# EAGLE design oa_sevenfortyfun (EAGLE 6.5.0)
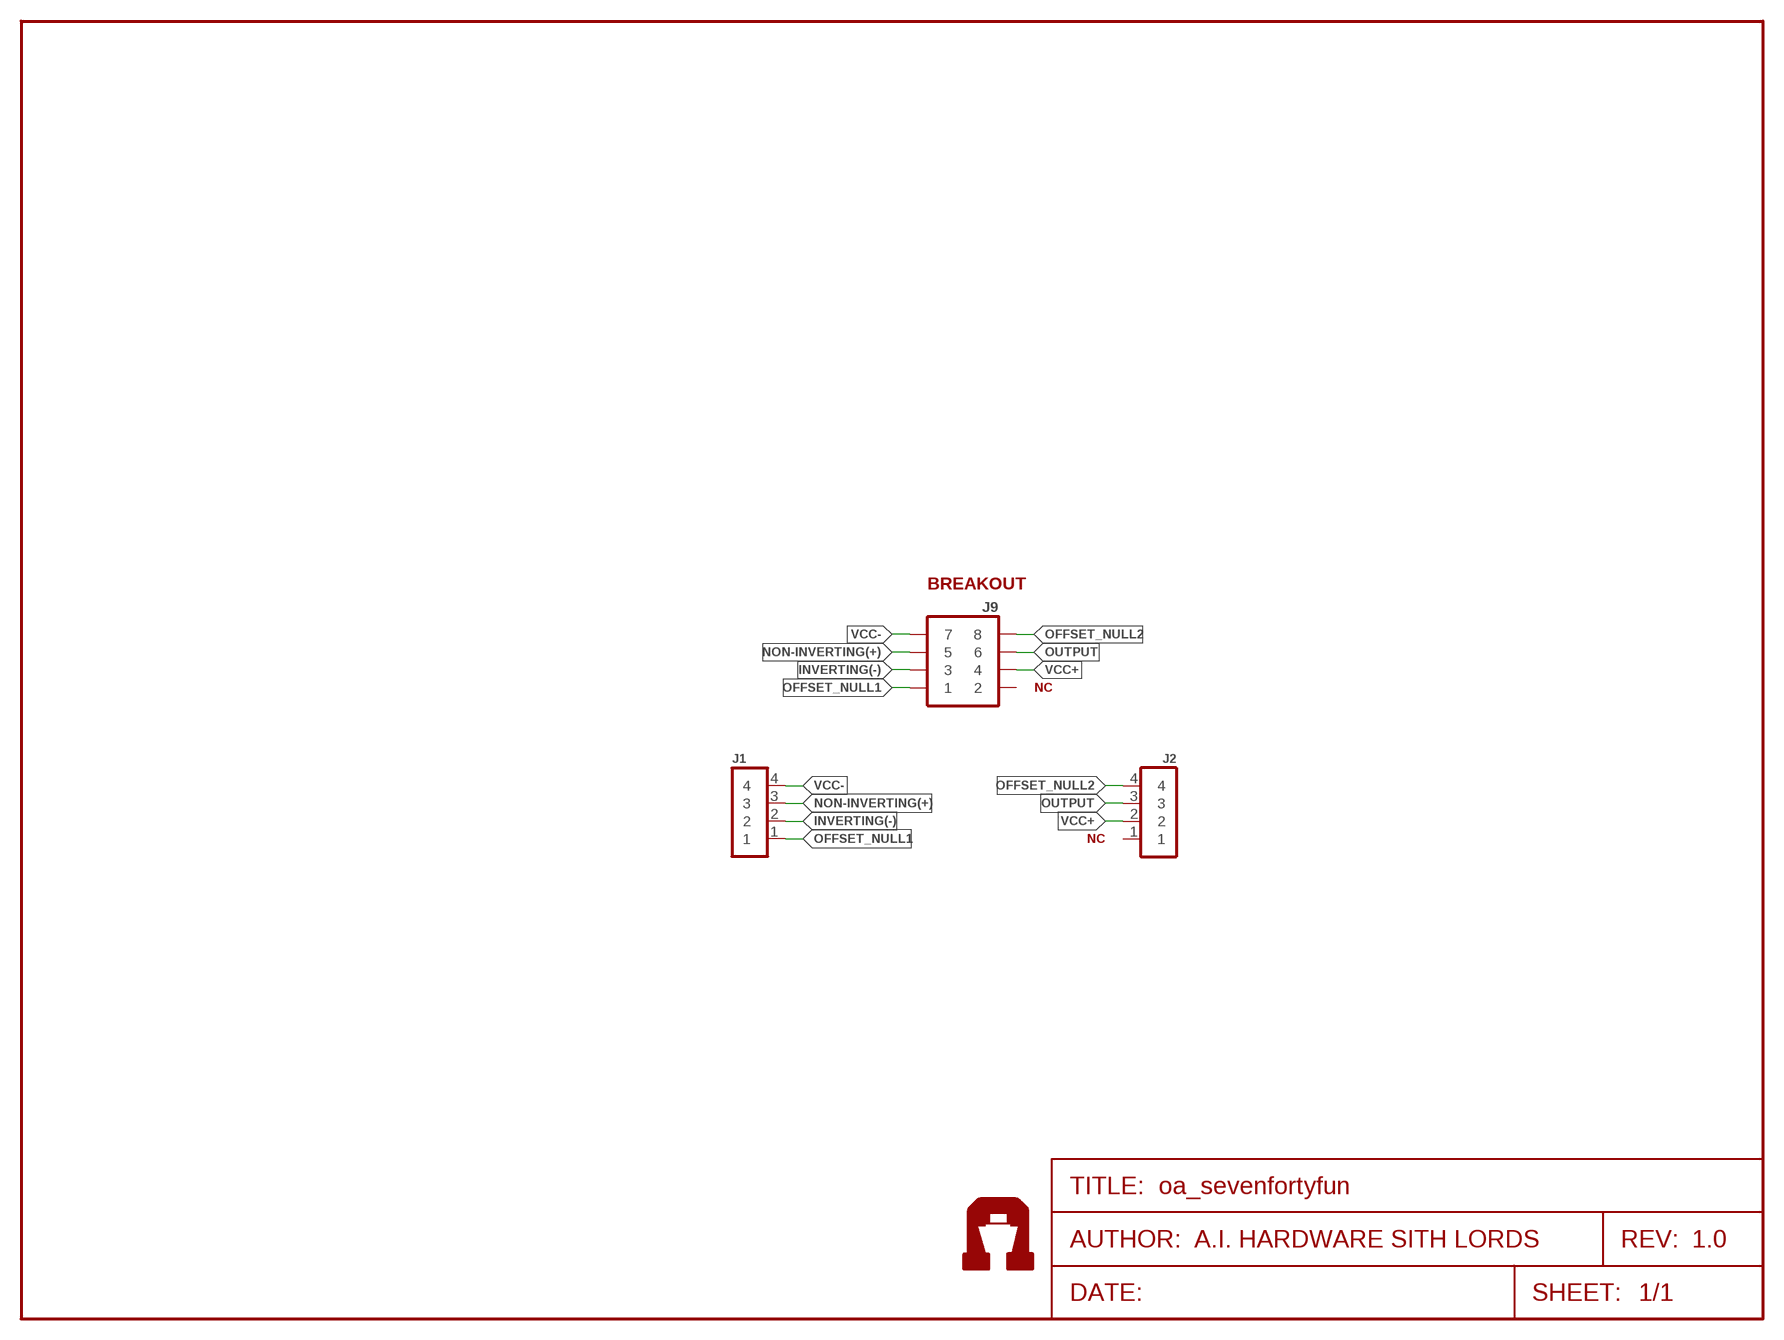
[diagram p0: schematic, sheet 1]
FRAME1 (FRAME-LETTER): AUTHOR: A.I. HARDWARE SITH LORDS; REV: 1.0

## Parts
J1  1X04NOSILK  [1X04-NOSILK]
J2  1X04NOFIRST  [1X04-NOFIRST]
J9  2X04SHR  [2X04-SHR]
U$3  AI-LOGOXS  [AI-LOGO-XS]

## Nets
INVERTING(-): J1.2 J9.3
NON-INVERTING(+): J1.3 J9.5
OFFSET_NULL1: J1.1 J9.1
OFFSET_NULL2: J2.4 J9.8
OUTPUT: J2.3 J9.6
VCC+: J2.2 J9.4
VCC-: J1.4 J9.7
Unconnected: J2.1 J9.2

## Notes on the sheet
- BREAKOUT
- NC
- NC

## Library data of the parts
J1 J2 = Ai_Connectors:1X04
J9 = Ai_Connectors:2X04
U$3 = Ai_Miscellany:AI-LOGO

## Net classes
0 signal: width 0.254 mm
1 power: width 0.305 mm

## Board
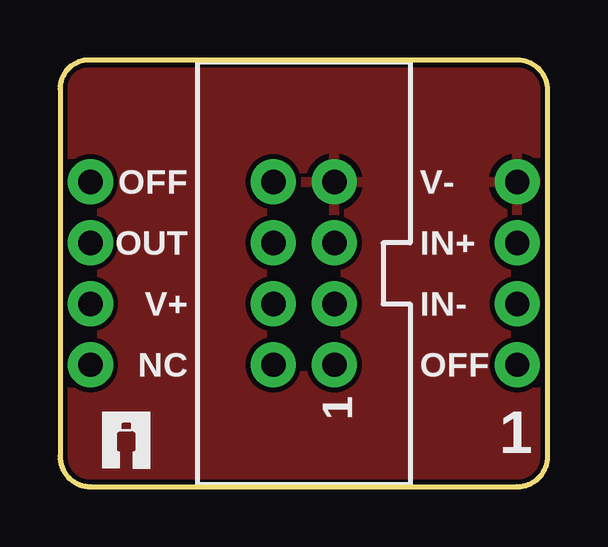
[diagram p1: board, top side]
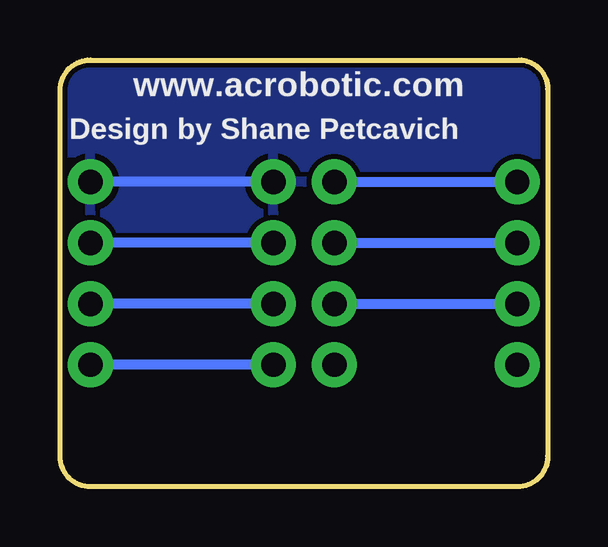
[diagram p2: board, bottom side, seen from below]

Size 20.32 x 17.78 mm. Coordinates in mm from the lower left corner, seen from the top.
Outline: 19.05,17.78 1.2,17.78 arc90 0,16.58 0,1.27 arc90 1.27,0 19.05,0 arc90 20.32,1.27 20.32,16.51 arc90 19.05,17.78
Copper layers (1*16): Top 0.035mm / dielectric 1.5mm / Bottom 0.035mm
Design rules "ai_2layer": minimum track width 7mil, minimum drill 15mil, track to track 8mil, track to pad 8mil, pad to pad 8mil, via to via 8mil, smd to smd 8mil, copper to edge 8mil, drill to drill 8mil, minimum pad ring 12mil, minimum via ring 10mil, stop-mask expansion 4mil, vias tented up to drill 20mil, thermal gap 10mil

### Footprints (pad centres in the part's own frame; a part is rotated, then mirrored left to right if it is on the bottom)
1X04-NOSILK = drill 1.016 pad 1.88: 1 -3.81,0; 2 -1.27,0; 3 1.27,0; 4 3.81,0
1X04-NOFIRST = drill 1.016 pad 1.88: 1 -3.81,0; 2 -1.27,0; 3 1.27,0; 4 3.81,0
2X04-SHR = drill 1.016 pad 1.88: 1 -3.81,-1.27; 2 -3.81,1.27; 3 -1.27,-1.27; 4 -1.27,1.27; 5 1.27,-1.27; 6 1.27,1.27; 7 3.81,-1.27; 8 3.81,1.27

### Placement (x,y rotation side)
J1  19.05,8.89 90 top
J2  1.27,8.89 90 top
J9  10.16,8.89 90 top
U$3  1.78,0.76 0 top

### Tracks (layer width: path | path; a pad name or v marks a point on that pad's centre or on a via)
INVERTING(-)
  Bottom 0.406: J9.3 J1.2
NON-INVERTING(+)
  Bottom 0.406: J9.5 J1.3
OFFSET_NULL1
  Bottom 0.406: J9.1 J1.1
OFFSET_NULL2
  Bottom 0.406: J9.8 J2.4
OUTPUT
  Bottom 0.406: J9.6 J2.3
VCC+
  Bottom 0.406: J9.4 J2.2
VCC-
  Bottom 0.406: J9.7 J1.4
  pour Bottom: 0,17.78 20.32,17.78 20.32,0 0,0
  pour Top: 0,0 0,17.78 20.32,17.78 20.32,0

### Text on the board
tPlace: OFF | V- | OUT | IN+ | V+ | IN- | NC | OFF | 1
bPlace: www.acrobotic.com | Design by Shane Petcavich